# EAGLE board board (EAGLE 9.4.2)
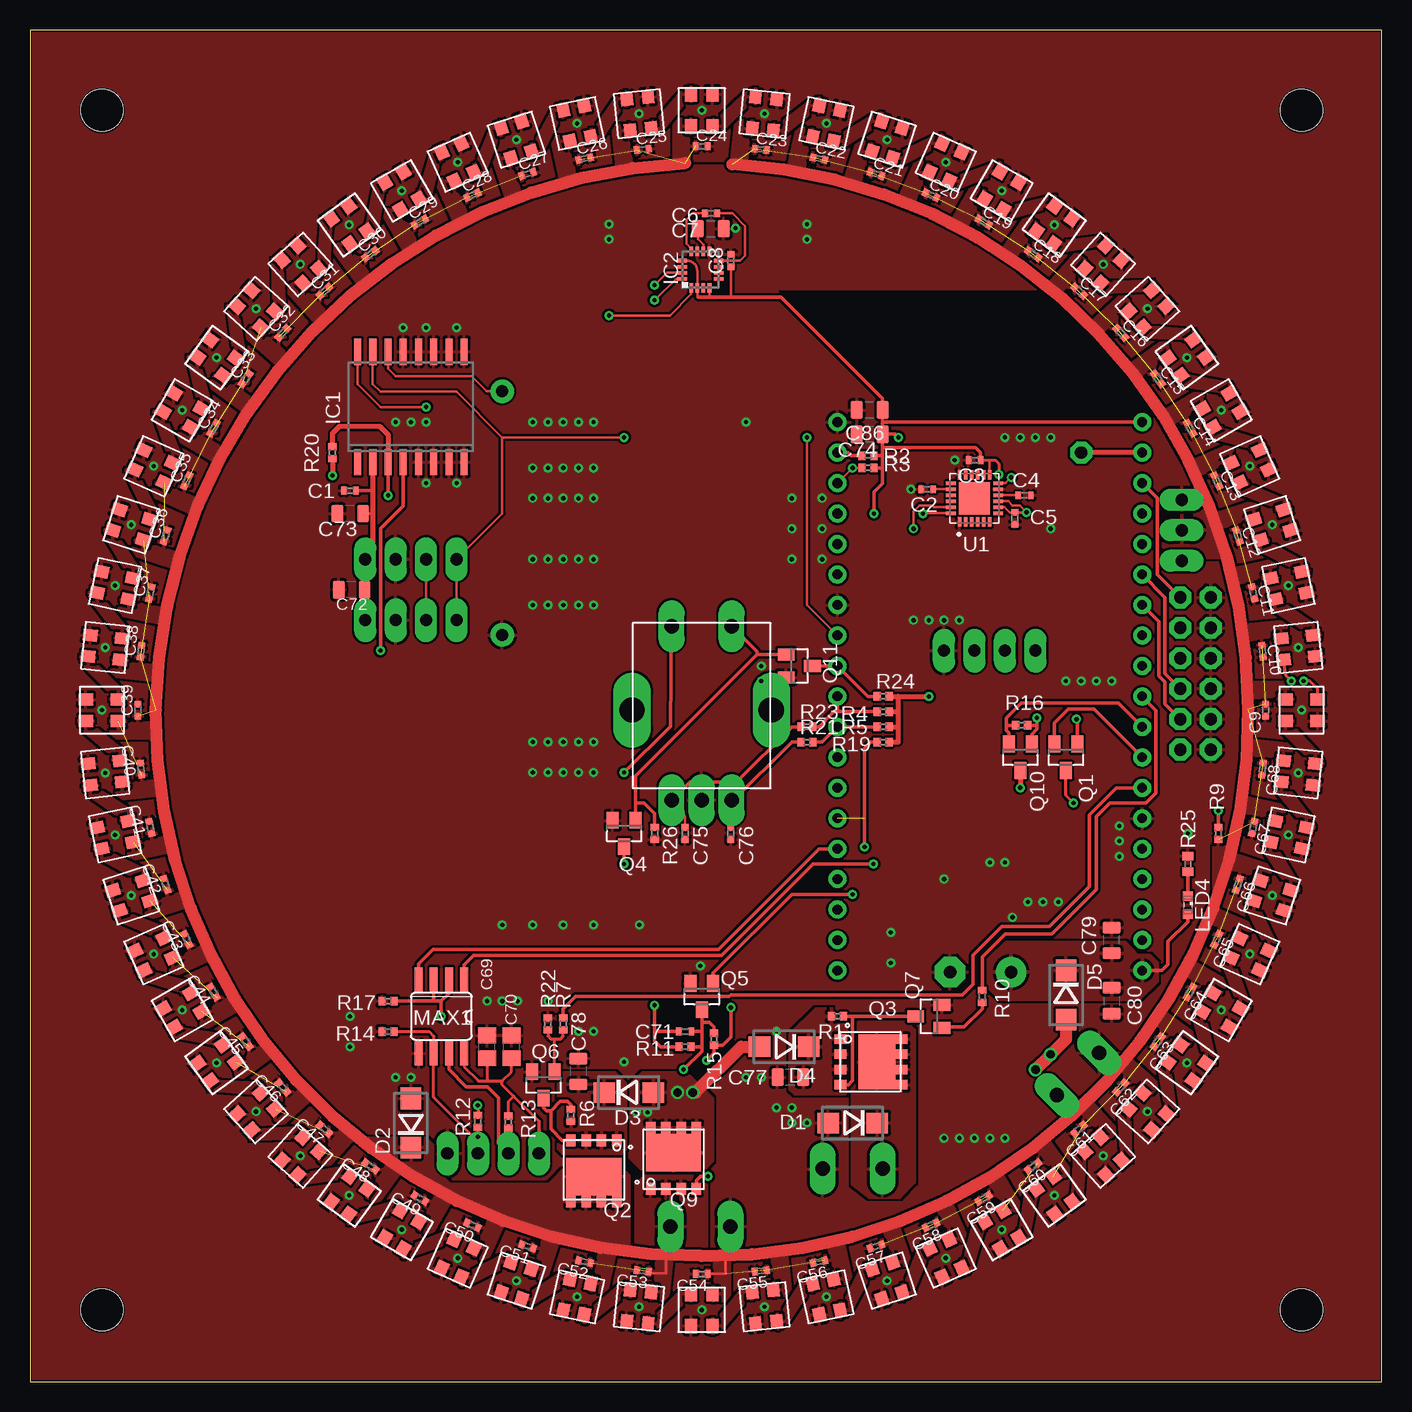
[diagram p5: board, top side]
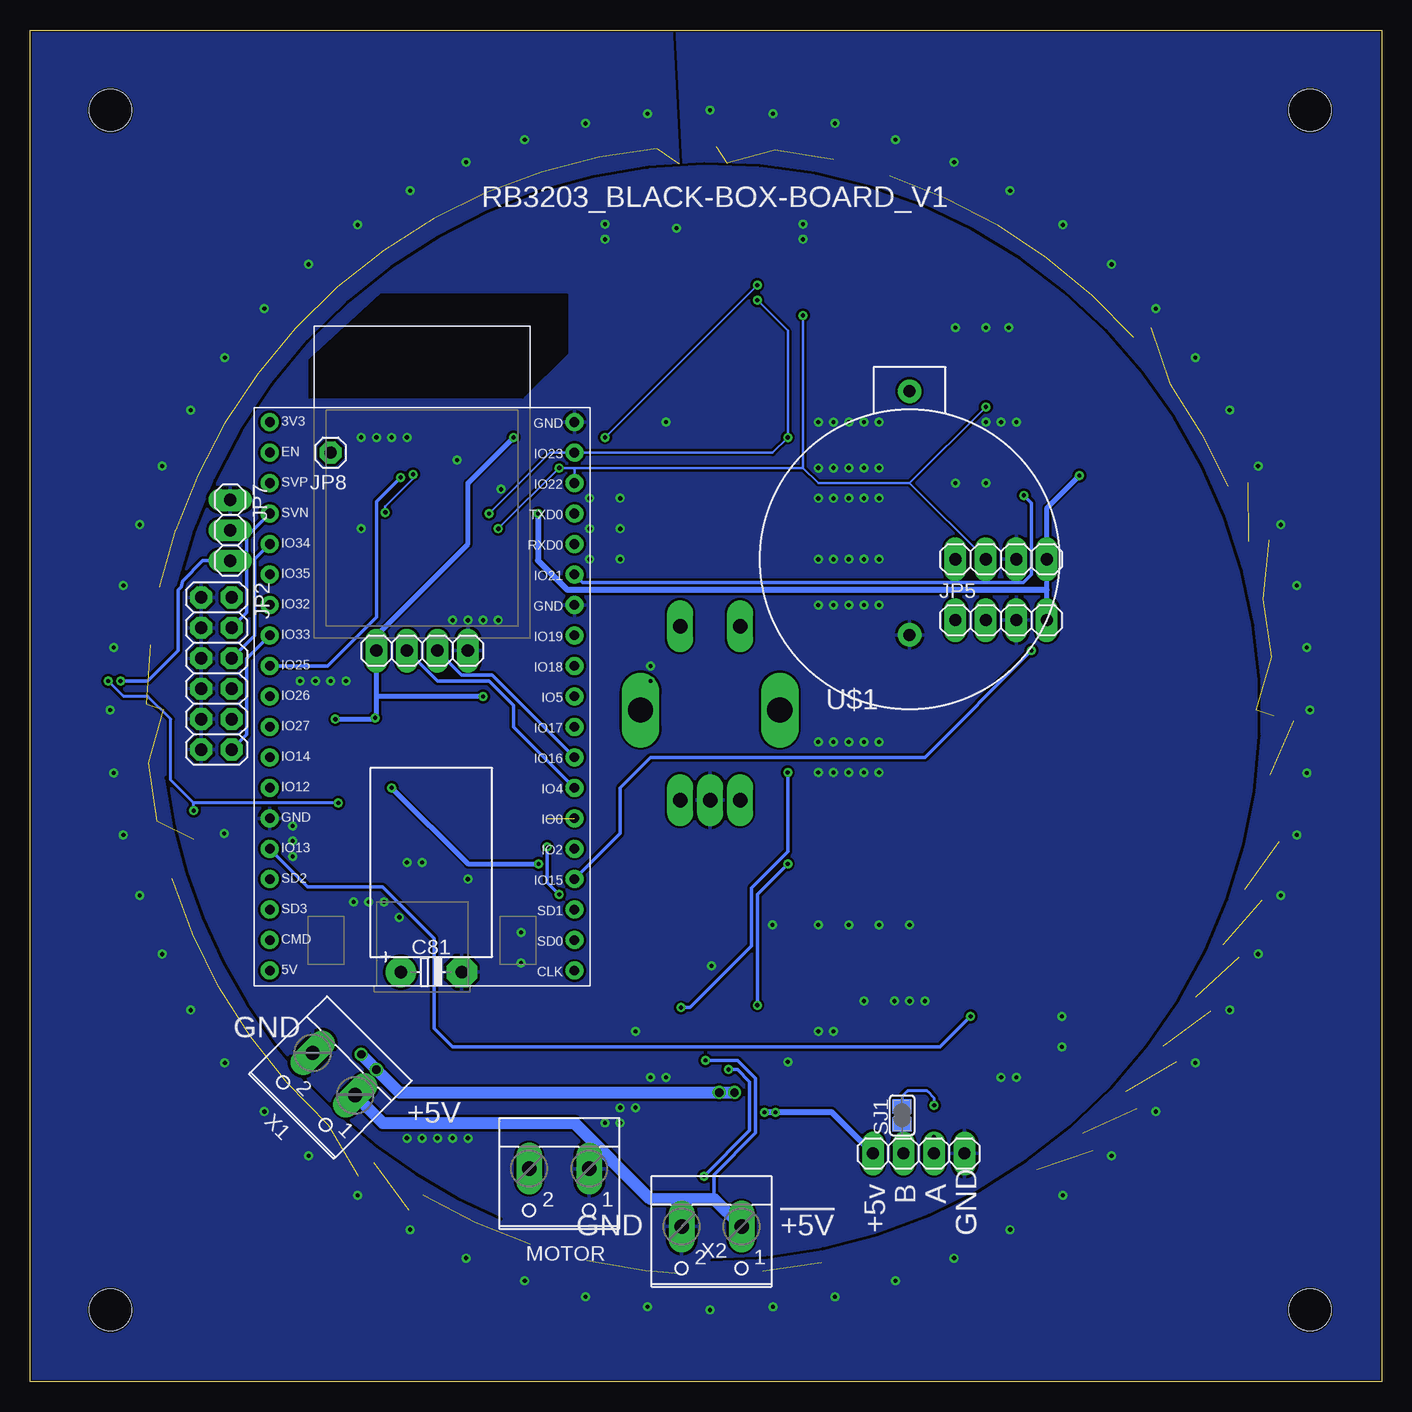
[diagram p6: board, bottom side, seen from below]

Size 112.7 x 112.7 mm. Coordinates in mm from the lower left corner, seen from the top.
Outline: 0,0 112.7,0 112.7,112.7 0,112.7 0,0
Copper layers (1*16): Top 0.035mm / dielectric 1.5mm / Bottom 0.035mm
Design rules "gatema_2layers *": minimum track width 0.15mm, minimum drill 0.3mm, track to track 0.15mm, track to pad 0.15mm, pad to pad 0.15mm, via to via 0.15mm, smd to smd 0mil, copper to edge 0.15mm, drill to drill 0.4mm, minimum pad ring 0.35mm, minimum via ring 0.2mm, stop-mask expansion 2mil, vias tented up to drill 0.4mm, thermal gap 10mil
Net classes: 0 default: width 0.2 mm, drill 0.35 mm, clearance 0.2 mm
Holes 3.5 mm at 6,106 106,106 106,6 6,6
tRestrict: 148 lines
bRestrict: 10 lines

## Footprints (pad centres in the part's own frame; a part is rotated, then mirrored left to right if it is on the bottom)
C0402 = smd 0.5 x 0.6: 1 -0.5,0; 2 0.5,0
C0402P = smd 0.45 x 0.6: 1 -0.525,0; 2 0.525,0
C0805 = smd 1 x 1.5: 1 -1.1,0; 2 1.05,0
C0805' = smd 1.3 x 1.5: 1 -0.95,0; 2 0.95,0
E5-10,5-H = drill 1.016 pad 2.54: + -2.54,0 | drill 1.016 pad 2.54 octagon: - 2.54,0
DO214BA = smd 1.8 x 1.7: A 2.05,0; C -2.05,0
SO16W = smd 0.6 x 2.2: 1 -4.445,-4.6; 2 -3.175,-4.6; 3 -1.905,-4.6; 4 -0.635,-4.6; 5 0.635,-4.6; 6 1.905,-4.6; 7 3.175,-4.6; 8 4.445,-4.6; 9 4.445,4.6; 10 3.175,4.6; 11 1.905,4.6; 12 0.635,4.6; 13 -0.635,4.6; 14 -1.905,4.6; 15 -3.175,4.6; 16 -4.445,4.6
QMC5882L-TR = smd 0.8 x 0.3: 1 -1.524,0.762; 2 -1.524,0.254; 3 -1.524,-0.254; 4 -1.524,-0.762; 9 1.524,-0.762; 10 1.524,-0.254; 11 1.524,0.254; 12 1.524,0.762 | smd 0.3 x 0.8: 5 -0.762,-1.524; 6 -0.254,-1.524; 7 0.254,-1.524; 8 0.762,-1.524; 13 0.762,1.524; 14 0.254,1.524; 15 -0.254,1.524; 16 -0.762,1.524
DEVKITC = drill 0.8: 1 -12.7,46.99; 2 -12.7,44.45; 3 -12.7,41.91; 4 -12.7,39.37; 5 -12.7,36.83; 6 -12.7,34.29; 7 -12.7,31.75; 8 -12.7,29.21; 9 -12.7,26.67; 10 -12.7,24.13; 11 -12.7,21.59; 12 -12.7,19.05; 13 -12.7,16.51; 14 -12.7,13.97; 15 -12.7,11.43; 16 -12.7,8.89; 17 -12.7,6.35; 18 -12.7,3.81; 19 -12.7,1.27; 20 12.7,1.27; 21 12.7,3.81; 22 12.7,6.35; 23 12.7,8.89; 24 12.7,11.43; 25 12.7,13.97; 26 12.7,16.51; 27 12.7,19.05; 28 12.7,21.59; 29 12.7,24.13; 30 12.7,26.67; 31 12.7,29.21; 32 12.7,31.75; 33 12.7,34.29; 34 12.7,36.83; 35 12.7,39.37; 36 12.7,41.91; 37 12.7,44.45; 38 12.7,46.99
1X04 = drill 1.016 long: 1 -3.81,0; 2 -1.27,0; 3 1.27,0; 4 3.81,0
2X06 = drill 1.016 octagon: 1 -6.35,-1.27; 2 -6.35,1.27; 3 -3.81,-1.27; 4 -3.81,1.27; 5 -1.27,-1.27; 6 -1.27,1.27; 7 1.27,-1.27; 8 1.27,1.27; 9 3.81,-1.27; 10 3.81,1.27; 11 6.35,-1.27; 12 6.35,1.27
1X03 = drill 1.016 long: 1 -2.54,0; 2 0,0; 3 2.54,0
1X01 = drill 1.016 octagon: 1 0,0
SML0603 = smd 0.8 x 0.8: A 0.75,0; C -0.75,0
SO08 = smd 0.66 x 2.032: 1 -1.905,-3.073; 2 -0.635,-3.073; 3 0.635,-3.073; 4 1.905,-3.073; 5 1.905,3.073; 6 0.635,3.073; 7 -0.635,3.073; 8 -1.905,3.073
W237-102 = drill 1.194 long: 1 -2.5,-1.27; 2 2.5,-1.27
SOT23 = smd 1 x 1.4: 1 -0.95,-1.1; 2 0.95,-1.1; 3 0,1.1
SOP-8_EP_5.0X5.0X1.27P = smd 0.8 x 1: 1 1.915,2.5; 2 0.645,2.5; 3 -0.625,2.5; 4 -1.895,2.5; 5 -1.895,-2.58; 6 -0.625,-2.58; 7 0.645,-2.58; 8 1.915,-2.58 | smd 4.61 x 3.1: 9 0.01,-0.53
R0402 = smd 0.6 x 0.7: 1 -0.5,0; 2 0.5,0
R0402' = smd 0.7 x 0.9: 1 -0.65,0; 2 0.65,0
SJ = smd 1.168 x 1.6: 1 -0.762,0; 2 0.762,0
QFN50P400X400X95-24N = smd 0.8 x 0.3: 1 -1.97,1.25; 2 -1.97,0.75; 3 -1.97,0.25; 4 -1.97,-0.25; 5 -1.97,-0.75; 6 -1.97,-1.25; 13 1.97,-1.25; 14 1.97,-0.75; 15 1.97,-0.25; 16 1.97,0.25; 17 1.97,0.75; 18 1.97,1.25 | smd 0.3 x 0.8: 7 -1.25,-1.97; 8 -0.75,-1.97; 9 -0.25,-1.97; 10 0.25,-1.97; 11 0.75,-1.97; 12 1.25,-1.97; 19 1.25,1.97; 20 0.75,1.97; 21 0.25,1.97; 22 -0.25,1.97; 23 -0.75,1.97; 24 -1.25,1.97 | smd 2.7 x 2.6: P$1 0,0
CH075 = drill 1 pad 1.93: + 14,0; - -6.3,0
WS2812B-MINI = smd 1.2 x 1: DIN 1.34,0.89; DOUT -1.34,-0.89; GND 1.34,-0.89; VCC -1.34,0.89
EC11-1S = drill 1.2 long: A -7.5,2.5; B -7.5,-2.5; IN -7.5,0; P$4 7,2.5; P$5 7,-2.5 | drill 2.1 long: P$1 0,-5.8; P$2 0,5.8

## Placement (x,y rotation side)
C1  1nf  [C0402]  26.67,74.3 180 top
C2  2.2nf  [C0402]  74.78,74.41 180 top
C3  100nf  [C0402]  78.74,76.83 180 top
C4  100nf  [C0402P]  82.9,73.91 0 top
C5  10nf  [C0402]  82.1,71.99 270 top
C6  220nf  [C0402]  56.77,97.41 0 top
C7  4.7uf  [C0805]  56.77,96.14 0 top
C8  100nf  [C0402P]  58.42,93.47 90 top
C9  [C0402]  103,56 270 top
C10  [C0402]  102.74,60.91 276 top
C11  [C0402]  101.97,65.77 282 top
C12  [C0402]  100.7,70.52 288 top
C13  [C0402]  98.94,75.12 294 top
C14  [C0402]  96.7,79.5 300 top
C15  [C0402]  94.02,83.63 306 top
C16  [C0402]  90.93,87.45 312 top
C17  [C0402]  87.45,90.93 318 top
C18  [C0402]  83.63,94.02 324 top
C19  [C0402]  79.5,96.7 330 top
C20  [C0402]  75.12,98.94 336 top
C21  [C0402]  70.52,100.7 342 top
C22  [C0402]  65.77,101.97 348 top
C23  [C0402]  60.91,102.74 354 top
C24  [C0402]  56,103 0 top
C25  [C0402]  51.09,102.74 6 top
C26  [C0402]  46.23,101.97 12 top
C27  [C0402]  41.48,100.7 18 top
C28  [C0402]  36.88,98.94 24 top
C29  [C0402]  32.5,96.7 30 top
C30  [C0402]  28.37,94.02 36 top
C31  [C0402]  24.55,90.93 42 top
C32  [C0402]  21.07,87.45 48 top
C33  [C0402]  17.98,83.63 54 top
C34  [C0402]  15.3,79.5 60 top
C35  [C0402]  13.06,75.12 66 top
C36  [C0402]  11.3,70.52 72 top
C37  [C0402]  10.03,65.77 78 top
C38  [C0402]  9.26,60.91 84 top
C39  [C0402]  9,56 90 top
C40  [C0402]  9.26,51.09 96 top
C41  100pf  [C0402]  10.03,46.23 102 top
C42  [C0402]  11.3,41.48 108 top
C43  [C0402]  13.06,36.88 114 top
C44  [C0402]  15.3,32.5 120 top
C45  [C0402]  17.98,28.37 126 top
C46  [C0402]  21.07,24.55 132 top
C47  [C0402]  24.55,21.07 138 top
C48  [C0402]  28.37,17.98 144 top
C49  [C0402]  32.5,15.3 150 top
C50  [C0402]  36.88,13.06 156 top
C51  [C0402]  41.48,11.3 162 top
C52  [C0402]  46.23,10.03 168 top
C53  [C0402]  51.09,9.26 174 top
C54  [C0402]  56,9 180 top
C55  [C0402]  60.91,9.26 186 top
C56  [C0402]  65.77,10.03 192 top
C57  [C0402]  70.52,11.3 198 top
C58  [C0402]  75.12,13.06 204 top
C59  [C0402]  79.5,15.3 210 top
C60  [C0402]  83.63,17.98 216 top
C61  [C0402]  87.45,21.07 222 top
C62  [C0402]  90.93,24.55 228 top
C63  [C0402]  94.02,28.37 234 top
C64  [C0402]  96.7,32.5 240 top
C65  [C0402]  98.94,36.88 246 top
C66  [C0402]  100.7,41.48 252 top
C67  [C0402]  101.97,46.23 258 top
C68  [C0402]  102.74,51.09 264 top
C69  10uf  [C0805']  38.1,27.94 90 top
C70  10uf  [C0805']  40.13,27.94 90 top
C71  100nf  [C0402P]  54.61,29.21 180 top
C72  10uf  [C0805]  26.8,66.04 180 top
C73  10uf  [C0805]  26.67,72.39 180 top
C74  10uf  [C0805]  69.98,78.99 180 top
C75  220nf  [C0402]  54.61,45.72 270 top
C76  220nf  [C0402]  58.42,45.72 270 top
C77  10uf  [C0805]  63.37,25.4 180 top
C78  10uf  [C0805]  45.72,25.91 90 top
C79  10uf  [C0805]  90.17,36.83 90 top
C80  10uf  [C0805]  90.17,31.75 270 top
C81  [E5-10,5-H]  79.25,34.16 0 bottom
C86  10uf  [C0805]  69.98,81.03 180 top
D1  [DO214BA]  68.58,21.59 180 top
D2  [DO214BA]  31.75,21.59 90 top
D3  BAT60JDO-214-AB  [DO214BA]  49.91,24.13 0 top
D4  BAT60JDO-214-AB  [DO214BA]  62.87,27.94 180 top
D5  BAT60JDO-214-AB  [DO214BA]  86.36,32.26 270 top
IC1  DS3231/SO  [SO16W]  31.75,81.28 0 top
IC2  QMC5883L-TR  [QMC5882L-TR]  55.88,92.71 90 top
IM1  DEVKITC  [DEVKITC]  80.01,33.02 0 bottom
JP1  [1X04]  38.61,19.05 180 bottom
JP2  [2X06]  97.16,59.05 270 bottom
JP3  [1X04]  80.01,60.96 0 bottom
JP4  [1X04]  31.75,68.58 0 bottom
JP5  [1X04]  31.75,63.5 0 bottom
JP7  [1X03]  96.01,70.99 270 bottom
JP8  [1X01]  87.63,77.47 180 bottom
LED4  powerled  [SML0603]  96.52,39.75 270 top
MAX1  MAX485  [SO08]  34.29,30.48 180 top
MOTOR  [W237-102]  68.58,16.51 180 bottom
Q1  [SOT23]  86.36,52.07 180 top
Q2  AO3401ASOP-8_EP_5.0X5.0X1.27P  [SOP-8_EP_5.0X5.0X1.27P]  46.99,17.65 0 top
Q3  AO3401ASOP-8_EP_5.0X5.0X1.27P  [SOP-8_EP_5.0X5.0X1.27P]  70.08,26.67 90 top
Q4  [SOT23]  49.53,45.72 180 top
Q5  [SOT23]  56,32.13 180 top
Q6  [SOT23]  42.8,24.77 180 top
Q7  [SOT23]  74.93,30.48 90 top
Q9  AO3401ASOP-8_EP_5.0X5.0X1.27P  [SOP-8_EP_5.0X5.0X1.27P]  53.66,18.58 180 top
Q10  [SOT23]  82.55,52.07 180 top
Q11  [SOT23]  64.14,59.69 270 top
R1  300k  [R0402]  67.31,30.48 180 top
R2  10k  [R0402]  69.85,77.22 0 top
R3  10k  [R0402]  69.85,76.2 0 top
R4  10k  [R0402]  71.12,55.88 0 top
R5  10k  [R0402]  71.12,54.61 0 top
R6  300k  [R0402]  45.09,22.23 90 top
R7  220  [R0402]  44.45,29.84 90 top
R9  10k  [R0402]  99.06,45.72 90 top
R10  220  [R0402]  79.38,32.13 90 top
R11  100k  [R0402]  54.61,27.94 180 top
R12  120  [R0402]  37.34,21.72 270 top
R13  20k  [R0402]  39.88,21.65 90 top
R14  20k  [R0402]  29.84,29.21 180 top
R15  100k  [R0402]  57.02,28.57 270 top
R16  10k  [R0402]  82.67,54.73 0 top
R17  100k  [R0402]  29.85,31.76 180 top
R19  100k  [R0402]  71.12,53.34 0 top
R20  47k  [R0402]  25.21,77.47 270 top
R21  180  [R0402]  64.77,53.34 0 top
R22  100k  [R0402]  43.18,29.84 270 top
R23  180  [R0402]  64.77,54.61 0 top
R24  10k  [R0402]  71.12,57.15 0 top
R25  1k  [R0402']  96.52,43.18 90 top
R26  100k  [R0402]  52.07,45.72 270 top
SJ1  [SJ]  40.01,22.23 270 bottom
U1  MPU-6050  [QFN50P400X400X95-24N]  78.74,73.66 90 top
U$1  CR2032  [CH075]  39.37,68.58 90 bottom
U$2  WS2812  [WS2812B-MINI]  105.73,61.23 6 top
U$3  WS2812  [WS2812B-MINI]  104.91,66.4 12 top
U$4  WS2812  [WS2812B-MINI]  103.55,71.45 18 top
U$5  WS2812  [WS2812B-MINI]  101.68,76.34 24 top
U$6  WS2812  [WS2812B-MINI]  99.3,81 30 top
U$7  WS2812  [WS2812B-MINI]  96.45,85.39 36 top
U$8  WS2812  [WS2812B-MINI]  93.16,89.46 42 top
U$9  WS2812  [WS2812B-MINI]  89.46,93.16 48 top
U$10  WS2812  [WS2812B-MINI]  85.39,96.45 54 top
U$11  WS2812  [WS2812B-MINI]  81,99.3 60 top
U$12  WS2812  [WS2812B-MINI]  76.34,101.68 66 top
U$13  WS2812  [WS2812B-MINI]  71.45,103.55 72 top
U$14  WS2812  [WS2812B-MINI]  66.4,104.91 78 top
U$15  WS2812  [WS2812B-MINI]  61.23,105.73 84 top
U$16  WS2812  [WS2812B-MINI]  56,106 90 top
U$17  WS2812  [WS2812B-MINI]  50.77,105.73 96 top
U$18  WS2812  [WS2812B-MINI]  45.6,104.91 102 top
U$19  WS2812  [WS2812B-MINI]  40.55,103.55 108 top
U$20  WS2812  [WS2812B-MINI]  35.66,101.68 114 top
U$21  WS2812  [WS2812B-MINI]  31,99.3 120 top
U$22  WS2812  [WS2812B-MINI]  26.61,96.45 126 top
U$23  WS2812  [WS2812B-MINI]  22.54,93.16 132 top
U$24  WS2812  [WS2812B-MINI]  18.84,89.46 138 top
U$25  WS2812  [WS2812B-MINI]  15.55,85.39 144 top
U$26  WS2812  [WS2812B-MINI]  12.7,81 150 top
U$27  WS2812  [WS2812B-MINI]  10.32,76.34 156 top
U$28  WS2812  [WS2812B-MINI]  8.45,71.45 162 top
U$29  WS2812  [WS2812B-MINI]  7.09,66.4 168 top
U$30  WS2812  [WS2812B-MINI]  6.27,61.23 174 top
U$31  WS2812  [WS2812B-MINI]  6,56 180 top
U$32  WS2812  [WS2812B-MINI]  6.27,50.77 186 top
U$33  WS2812  [WS2812B-MINI]  7.09,45.6 192 top
U$34  WS2812  [WS2812B-MINI]  8.45,40.55 198 top
U$35  WS2812  [WS2812B-MINI]  10.32,35.66 204 top
U$36  WS2812  [WS2812B-MINI]  12.7,31 210 top
U$37  WS2812  [WS2812B-MINI]  15.55,26.61 216 top
U$38  WS2812  [WS2812B-MINI]  18.84,22.54 222 top
U$39  WS2812  [WS2812B-MINI]  22.54,18.84 228 top
U$40  WS2812  [WS2812B-MINI]  26.61,15.55 234 top
U$41  WS2812  [WS2812B-MINI]  31,12.7 240 top
U$42  WS2812  [WS2812B-MINI]  35.66,10.32 246 top
U$43  WS2812  [WS2812B-MINI]  40.55,8.45 252 top
U$44  WS2812  [WS2812B-MINI]  45.6,7.09 258 top
U$45  WS2812  [WS2812B-MINI]  50.77,6.27 264 top
U$46  WS2812  [WS2812B-MINI]  56,6 270 top
U$47  WS2812  [WS2812B-MINI]  61.23,6.27 276 top
U$48  WS2812  [WS2812B-MINI]  66.4,7.09 282 top
U$49  WS2812  [WS2812B-MINI]  71.45,8.45 288 top
U$50  WS2812  [WS2812B-MINI]  76.34,10.32 294 top
U$51  WS2812  [WS2812B-MINI]  81,12.7 300 top
U$52  WS2812  [WS2812B-MINI]  85.39,15.55 306 top
U$53  WS2812  [WS2812B-MINI]  89.46,18.84 312 top
U$54  WS2812  [WS2812B-MINI]  93.16,22.54 318 top
U$55  WS2812  [WS2812B-MINI]  96.45,26.61 324 top
U$56  WS2812  [WS2812B-MINI]  99.3,31 330 top
U$57  WS2812  [WS2812B-MINI]  101.68,35.66 336 top
U$58  WS2812  [WS2812B-MINI]  103.55,40.55 342 top
U$59  WS2812  [WS2812B-MINI]  104.91,45.6 348 top
U$60  WS2812  [WS2812B-MINI]  105.73,50.77 354 top
U$61  WS2812  [WS2812B-MINI]  106,56 0 top
U$62  EC11-1S  [EC11-1S]  56,56 90 top
X1  [W237-102]  88.27,24.77 135 bottom
X2  [W237-102]  55.88,11.68 180 bottom

## Tracks (layer width: path | path; a pad name or v marks a point on that pad's centre or on a via)
3,3!KNOFLIK
  Top 0.2: IC1.14 29.84,84.45 30.46,83.84 36.81,83.84 38.07,82.58 U$1.+
!ENC-A
  Top 0.2: U$62.A 54.61,47.15 C75.1
  Top 0.305: U$62.A 55.01,50.01 58.9,50.01 63.5,54.61 R23.1
!ENC-B
  Top 0.2: C76.1 58.42,48.26 58.54,48.38
  Top 0.305: R21.1 63.5,53.34 58.54,48.38 U$62.B
+3V3  (via drill 0.35)
  Top 0.2: U1.13 79.99,76.83 | U1.8 81.25,72.91 81.67,72.49 C5.1 v83.08,72.49 | IC2.13 54.76,93.47 arc-45 55.37,93.22 arc-45 55.63,92.61 IC2.2 55.63,90.47 55.68,90.42 | v83.08,72.49 | C8.1 58.42,90.42 | IC2.4 56.64,90.42 | U1.9 81.55,73.41 81.91,73.06 82.51,73.06 v83.08,72.49
  Top 0.254: C73.1 28.57,72.39 | C3.1 79.99,76.83 80.47,76.83 80.75,76.55 v80.75,75.66
  Top 0.305: Q10.1 83.5,53.98 83.94,54.42 83.94,54.73 | R16.2 83.94,54.73 | 83.94,54.73 v83.94,55.37 | v87.25,55.24 87.31,55.18 Q1.1 | C1.1 28.57,74.3 | C3.1 79.24,77.46 78.82,77.88 71.08,77.88 | 27.94,66.04 | 27.94,66.04 C72.1 | C74.1 71.08,80.01 | 71.08,80.01 IM1.1 | C74.1 71.08,77.88 | R2.2 71.08,77.22 | 71.08,77.22 71.08,77.88 | R3.2 71.08,76.2 | 71.08,77.22 71.08,76.2 | 71.08,76.2 71.08,74.89 70.36,74.17 v70.36,72.39 | 71.08,80.01 C86.1 71.08,81.96 62.61,90.42 58.42,90.42 56.64,90.42 55.68,90.42 | C74.1 72.14,78.99 v72.39,78.74 | JP5.4
  Top 0.406: R5.2 72.39,54.61 | IC1.2 28.57,74.3 28.57,72.39 28.57,69.22 JP4.4 27.94,66.04 | R19.2 72.39,53.34 72.39,54.61 | R4.2 72.39,55.88 | 72.39,54.61 72.39,55.88 | 72.39,55.88 72.39,57.15 | R20.2 v25.21,75.56 | R24.2 72.39,57.15 | 72.39,57.15 v74.93,57.15 | C72.1 27.94,66 JP5.4
  Bottom 0.2: v83.08,72.49 83.08,72.99 80.75,75.32 v80.75,75.66
  Bottom 0.305: 83.82,55.48 83.82,57.15 JP3.1
  Bottom 0.406: v25.21,75.56 27.94,72.83 JP4.4 27.94,66.04 JP5.4 | v74.93,57.15 83.82,57.15 | v87.25,55.24 84.06,55.24 v83.94,55.37 83.82,55.48 JP3.1 83.82,62.23 76.2,69.85 76.2,74.93 v72.39,78.74
  Bottom 0.508: 27.94,66.04 67.92,66.04 70.36,68.47 v70.36,72.39
+5V  (via drill 0.35, 0.7)
  Top 0.254: 40.32,23.81 39.37,24.75 39.37,25.09 | 42.42,21.7 40.32,23.81 | MAX1.8 36.2,26.27 37.38,25.09 38.1,25.09 | C69.1 38.1,25.09 | 38.1,25.09 39.37,25.09 | R13.2 39.88,23.37 40.32,23.81 | 39.37,25.09 40.13,25.85 C70.1
  Top 0.305: JP1.4 42.42,21.7
  Top 1.016: D5.A 86.36,28.57 v85.09,27.3 v83.82,26.04 | v55.24,24.13 55.5,24.13 59.31,27.94 D4.A
  Bottom 0.508: JP1.4 45.85,22.48 v50.55,22.48 v51.47,22.48
  Bottom 1.016: v85.09,27.3 81.92,24.13 v55.24,24.13 v53.98,24.13
  pour Top (rank 2): 50.04,24.77 50.04,18.67 51.18,17.53 56.01,17.53 56.9,18.41 56.9,23.62 54.74,25.78 51.05,25.78
+5VA
  Top 0.305: IM1.19 94.36,34.29 94.87,34.8 94.87,36.72 96.52,38.37 LED4.A
  pour Top: 79.76,35.56 79.76,33.02 80.9,31.88 92.46,31.88 93.98,33.4 93.98,34.92 93.34,35.56 92.33,35.56 91.31,36.62 80.77,36.62
A  (via drill 0.35)
  Top 0.254: R12.2 v37.34,20.44 36.95,20.44 33.66,23.73 MAX1.6 33.66,28.82 33.26,29.21 R14.1
  Bottom 0.305: JP1.2 v37.34,20.44
B
  Top 0.254: 39.05,19.99 39.05,20.32
  Top 0.305: R13.1 JP1.3 39.05,19.88 39.05,20.32 39.05,23.69 38.13,24.61 36.35,24.61 34.92,26.04 MAX1.7
  Bottom 0.254: 39.88,21.34 SJ1.2
  Bottom 0.305: SJ1.2 40.01,19.18 JP1.3
DS3231/RST  (via drill 0.35)
  Top 0.305: IC1.4 31.11,73.03 29.21,71.12 v29.21,60.96
  Bottom 0.305: v29.21,60.96 38.1,52.07 60.96,52.07 63.5,49.53 63.5,45.72 IM1.23
ENC-A
  Top 0.305: R23.2 65.79,54.61 66.21,55.03 | 66.21,55.03 66.28,55.1 | R4.1 67.31,55.88 | 66.21,55.03 66.21,55.07 67.02,55.88 67.31,55.88 | IM1.29 67.31,55.88
ENC-B
  Top 0.305: R21.2 66.04,53.34 IM1.28 R5.1
ESP_SHUTDOWN  (via drill 0.35)  (1 unrouted)
  Top 0.305: v68.58,40.64 63.5,40.64 56.95,34.09 Q5.1 | v69.58,44.6 69.58,46.99 69.58,52.81 70.1,53.34 R19.1
  Bottom 0.305: v69.58,44.6 69.58,41.64 v68.58,40.64
GND  (via drill 0.35)
  other vias: 58.8,96.18 41.91,53.34 43.18,53.34 45.72,53.34 45.72,50.8 43.18,50.8 41.91,50.8 46.99,50.8 46.99,53.34 73.66,63.5 74.93,63.5 76.2,63.5 77.47,63.5 80.01,43.31 81.28,43.31 76.2,41.91 106.01,56 56,5.99 61.23,6.27 66.4,7.09 71.45,8.44 76.34,10.32 81,12.69 85.39,15.54 89.46,18.84 93.16,22.54 96.46,26.61 99.31,31 101.68,35.66 103.56,40.55 104.91,45.6 105.73,50.77 105.73,61.23 104.91,66.4 103.56,71.45 101.68,76.34 99.31,81 96.46,85.39 93.16,89.46 89.46,93.16 85.39,96.46 81,99.31 76.34,101.68 71.45,103.56 66.4,104.91 61.23,105.73 56,106.01 50.77,105.73 45.6,104.91 40.55,103.56 35.66,101.68 31,99.31 26.61,96.46 22.54,93.16 18.84,89.46 15.54,85.39 12.69,81 10.32,76.34 8.44,71.45 7.09,66.4 6.27,61.23 5.99,56 6.27,50.77 7.09,45.6 8.44,40.55 10.32,35.66 12.69,31 15.54,26.61 18.84,22.54 22.54,18.84 26.61,15.54 31,12.69 35.66,10.32 40.55,8.44 45.6,7.09 50.77,6.27 43.18,31.75 38.1,31.75 39.37,31.75 40.64,31.75 31.75,25.4 30.48,25.4 26.67,30.48 26.67,27.94 59.69,25.4 62.23,29.21 83.19,40.01 71.75,37.47 71.75,34.92 81.92,38.73 50.8,38.1 46.99,38.1 44.45,38.1 41.91,38.1 39.37,38.1 31.11,87.88 33.02,87.88 35.56,87.88 73.44,74.41 41.91,76.2 43.18,76.2 44.45,76.2 46.99,76.2 30.48,80.01 31.75,80.01 33.02,80.01 85.09,71.12 55.88,34.67 96.52,45.72 77.47,20.32 78.74,20.32 80.01,20.32 76.2,20.32 81.28,20.32 59.69,80.01 33.02,74.93 35.56,74.93 43.18,64.77 44.45,64.77 64.77,96.52 48.26,96.52 48.26,95.25 64.77,95.25 45.72,76.2 45.72,64.77 46.99,64.77 41.91,73.66 43.18,73.66 44.45,73.66 45.72,73.66 46.99,73.66 46.99,80.01 45.72,80.01 44.45,80.01 43.18,80.01 41.91,80.01 41.91,64.77 44.45,53.34 44.45,50.8 41.91,68.58 43.18,68.58 44.45,68.58 45.72,68.58 46.99,68.58 81.28,78.74 82.55,78.74 83.82,78.74 85.09,78.74 64.77,21.59 63.5,21.59 62.23,22.86 60.96,25.4 63.5,22.86 46.99,29.21 45.72,29.21 49.53,26.67 86.36,58.42 87.63,58.42 88.9,58.42 90.17,58.42 77.09,76.83 90.81,45.09 90.81,46.35 90.81,43.81 60.96,58.42 60.96,59.69 63.5,73.66 63.5,71.12 63.5,68.58 66.04,71.12 66.04,73.66 66.04,68.58 84.45,40.01 85.72,40.01
  pour Top (rank 6): -1.15,114.42 -1.15,-1.15 114.42,-1.15 114.42,114.42
  pour Bottom: -2.42,115.69 -2.42,-2.42 115.69,-2.42 115.69,115.69
INT_MPU5060  (via drill 0.35)
  Top 0.2: v81.8,75.4 81.31,74.91 U1.12
  Bottom 0.305: v81.8,75.4 83.82,73.38 83.82,63.75 87.88,59.69 IM1.9
IO32
  Top 0.305: JP2.10 94.62,56.51 94.62,58.34 94.11,58.84 94.11,62.35 94.11,62.36 94.11,63.37 IM1.7
IO33
  Bottom 0.305: IM1.8 94.62,60.32 94.62,53.97 JP2.12
IO34
  Bottom 0.305: IM1.5 93.98,68.58 93.98,62.23 JP2.6
IO35
  Top 0.305: IM1.6 94.62,65.4 94.62,59.05 JP2.8
LED4
  Top 0.305: LED4.C R25.1
LED-SHUTDOWN
  Top 0.29: 52.07,32.13 57.15,32.13
  Top 0.305: R7.2 44.45,31.11 45.47,32.13 52.07,32.13 | 57.15,32.13 58.27,32.13 58.42,32.28 77.75,32.28 78.61,33.15 78.61,35.56 81.03,37.97 84.96,37.97 88.3,41.31 88.3,47.28 90.55,49.53 IM1.13
MODE_485  (via drill 0.35)
  Top 0.305: v34.29,30.48 34.29,31.74 | R17.1 33.66,31.76 | 33.66,31.76 34.28,31.76 34.29,31.74 | 34.29,31.74 34.92,32.38 MAX1.2 | MAX1.3 33.66,31.76
  Bottom 0.305: v34.29,30.48 36.83,27.94 77.47,27.94 78.99,29.46 78.99,36.96 83.31,41.27 88.9,41.27 89.53,41.27 IM1.15
MOTOR
  Top 0.305: R10.2 79.38,35.43 81.3,37.36 85.19,37.36 88.9,41.07 88.9,47.12 90.04,48.26 93.03,48.26 93.87,49.1 93.87,55.99 IM1.10
N$1
  Top 0.2: U1.20 76.2,74.41 75.84,74.41 C2.1
N$2  (via drill 0.35)
  Top 0.305: Q4.3 v49.53,43.18 | R11.2 52.58,27.94 52.07,28.45 52.07,29.21 | 52.07,29.21 v52.07,31.4 | C71.2 52.07,29.21
  Bottom 0.305: v49.53,43.18 52.07,40.64 v52.07,31.4
N$3
  Top 0.2: U1.10 C4.1
N$6  (via drill 0.35)
  Top 0.305: Q9.4 55.55,16.82 55.88,17.14 v56.52,17.14 | 56,27.94 56,27.55 v54.48,26.04 | 56,27.94 56,29.21 | 56,29.21 56,29.97 | 56,29.97 Q5.3 | R11.1 56,27.94 | R15.1 57.02,29.59 56.64,29.97 56,29.97 | C71.1 56,29.21
  Bottom 0.305: v56.52,17.14 52.7,20.95 52.7,25.02 53.72,26.04 v54.48,26.04
N$7
  pour Top: 44.07,19.43 44.58,18.92 49.15,18.92 49.66,19.43 49.66,24.89 48.77,25.78 44.45,25.78 44.07,25.4
N$8  (via drill 0.35)
  Top 0.254: v37.33,23.04 v37.34,23.04 R12.1
  Bottom 0.254: v37.33,23.04 37.33,23.68 37.9,24.25 39.55,24.25 40.01,23.8 SJ1.1
N$9  (via drill 0.35)
  Top 0.254: U$2.DOUT 104.54,59.74 | 104.54,59.74 | 104.54,59.74 104.59,59.31 arc35 104.82,58.75 v105.16,58.42
  Bottom 0.305: JP7.3 98.3,68.45 99.97,66.78 100.09,66.25 100.33,66.02 100.33,60.96 102.87,58.42 v105.16,58.42
N$10
  Top 0.406: IM1.2 JP8.1
N$11
  pour Top (rank 2): 68.52,29.49 68.52,16.45 69.97,15.36 72.51,15.36 73.78,16.63 73.78,29.36 72.93,30.22 69.25,30.22
N$12
  Top 0.305: Q3.4 68.21,24.77 68.58,25.15 68.58,30.48 | 68.58,30.48 Q7.3 | R1.1 68.58,30.48
N$13
  Top 0.305: Q7.1 76.09,29.59 77.85,29.59 79.38,31.11 R10.1
N$14
  pour Top: 63.37,28.96 63.37,24.38 63.75,24 67.94,24 68.33,24.38 68.33,30.1 67.31,31.11 65.53,31.11
N$47
  pour Top: 74.18,11.32 74.76,11.57 75.2,10.64 74.78,10.45 73.36,7.02 72.87,6.87 72.5,8 72.99,8.16
N$60
  Top 0.2: C6.1 55.24,97.41 54.74,96.9 54.74,94.87 55.12,94.49 IC2.12
N$62
  Top 0.2: C6.2 58.55,97.41 59.59,96.37 59.59,93.88 59.18,93.47 IC2.8
N$66
  Top 0.2: C7.1 55.67,95.25 56.13,94.78 IC2.10
N$68
  Top 0.305: R6.2 45.09,23.11 44.83,23.37 44.2,23.37 43.43,22.61 | 43.43,22.61 43.05,22.61 42.8,22.86 Q6.3 | Q2.4 44.37,20.15 43.43,21.08 43.43,22.61
N$69
  Top 0.254: R22.2 43.18,28.83 43.43,28.57 43.75,28.57 | R7.1 44.45,28.83 44.2,28.57 43.75,28.57 | Q6.1 43.75,28.57
QMC5883-INTERRUPT  (via drill 0.35)
  Top 0.2: IC2.15 53.09,92.46 v52.07,91.44 | IM1.31 64.77,64.77 v64.77,78.74
  Bottom 0.2: v52.07,91.44 v64.77,78.74
RX-485-5V  (via drill 0.35)
  Top 0.305: MAX1.1 36.2,34.77 36.99,35.56 57.66,35.56 65.28,43.18 v70.3,43.18
  Top 0.406: Q10.3 v82.55,49.53
  Bottom 0.406: v82.55,49.53 76.2,43.18 v70.3,43.18
RX-GPS
  Bottom 0.305: JP3.2 78.74,58.42 74.42,58.42 72.39,56.39 72.39,54.61 IM1.26
RX_485
  Top 0.305: 81.4,54.73 81.4,54.31 81.6,54.11 Q10.2 | 81.4,54.73 R16.1 | 81.4,54.73 81.4,55.37 82.64,56.6 90.17,56.6 90.72,56.6 IM1.11
SCL  (via drill 0.35)  (1 unrouted)
  Top 0.2: IC1.16 27.3,83.19 29.21,81.28 v33.02,81.28 | IC2.1 55.12,90.68 53.34,88.9 v48.26,88.9 | U1.23 75.36,72.91 75.21,73.06 74.15,73.06 73.66,72.58 v73.66,71.12 | JP4.2 JP5.2 | R3.1 v68.58,76.2 IM1.36
  Bottom 0.2: v73.66,71.12 v68.58,76.2 | JP4.2 39.37,74.93 | 39.37,74.93 46.99,74.93 48.26,76.2 | 39.37,74.93 v33.02,81.28 | v48.26,88.9 48.26,76.2 | v68.58,76.2 | v68.58,76.2 67.31,76.2 | 67.31,76.2 48.26,76.2 | 67.31,76.2 IM1.36
SDA  (via drill 0.35)
  Top 0.2: IC1.15 28.57,83.19 29.21,82.55 35.56,82.55 39.37,78.74 | U1.24 74.45,72.41 v74.43,72.39 | v52.07,90.17 53.85,91.95 IC2.16 | v49.53,78.74 39.37,78.74 | 39.37,78.74 39.37,72.39 JP4.1 JP5.1
  Top 0.305: R2.1 68.45,77.22 68.2,77.47 IM1.37
  Bottom 0.2: v74.43,72.39 69.35,77.47 IM1.37 50.8,77.47 v49.53,78.74 49.53,87.63 v52.07,90.17
SQW/INT  (via drill 0.35)
  Top 0.305: IC1.3 v29.84,73.9
  Top 0.406: R20.1 25.21,79.08 25.78,79.65 29.17,79.65 29.84,78.98 IC1.3
  Bottom 0.305: 29.2,73.26 v29.84,73.9 29.21,73.27 29.21,67.31 29.87,66.65 66.65,66.65 IM1.33
SVN
  Bottom 0.305: IM1.4 94.62,70.48 94.62,64.13 JP2.4
SVP
  Top 0.305: JP2.2 93.98,67.31 93.98,73.66 IM1.3
SW
  Top 0.305: Q11.3 IM1.30 69.85,57.15 R24.1
SW0  (via drill 0.35)
  Top 0.305: U$62.P$4 53.38,54.65 v49.53,50.8 | v56.39,26.8 57.02,27.43 R15.2 57.72,28.07 58.42,28.78 v58.42,31.21
  Bottom 0.305: 55.67,15.24 55.67,17.28 52.2,20.75 52.2,25.29 53.72,26.8 v56.39,26.8 | v49.53,50.8 49.53,44.21 52.58,41.16 52.58,36.33 57.69,31.21 v58.42,31.21
  Bottom 1.016: X2.1 55.67,15.24 60.96,15.24 67.31,21.59 83.29,21.59 X1.1
  pour Top: 50.48,16.44 50.48,11.36 51.24,10.6 56,10.6 56.44,11.04 56.44,16.45 55.75,17.14 51.18,17.14
SW1
  Top 0.305: Q11.1 60.62,60.64 | Q4.1 50.48,48.26 | 50.48,48.26 50.48,50.5 60.62,60.64 | 50.48,48.26 51.18,48.26 52.07,47.37 R26.1 | U$62.P$5 60.62,60.88 60.62,60.64
TX-GPS
  Bottom 0.305: JP3.3 76.7,58.92 74.17,58.92 IM1.27
TX_485
  Top 0.305: MAX1.4 32.38,34.84 33.6,36.06 57.4,36.06 65.79,44.45 IM1.24
VCC  (54 unrouted)
  Top 0.2: C53.1 51.68,9.07 53.01,9.07 53.01,10.5 56,10.5 57.99,10.5 57.99,9 C54.1
  Top 1.016: 58.55,101.5 arc-87 101.56,56.06 arc-92 56,10.5 arc-92 10.5,56 arc-87 54.61,101.6
  pour Top (rank 2): 102.63,56.13 103.37,56.13 103.37,57.04 104.08,57.37 104.08,56.89 105.25,56.89 105.25,58.31 101.72,58.31 101.72,57.27 101.92,57.07 102.63,57.07
  pour Top (rank 2): 102.37,61 103.1,61.08 103,61.99 103.68,62.39 103.73,61.83 104.9,61.95 104.74,63.45 101.23,63.08 101.34,62.04 101.56,61.86 102.27,61.94
  pour Top (rank 2): 101.59,65.82 102.31,65.97 102.12,66.87 102.75,67.34 102.87,66.78 104.01,67.02 103.69,68.5 100.24,67.77 100.46,66.75 100.7,66.59 101.39,66.74
  pour Top (rank 2): 100.31,70.53 101.01,70.76 100.73,71.63 101.31,72.16 101.44,71.74 102.55,72.1 102.13,73.42 98.77,72.33 99.09,71.34 99.35,71.21 100.02,71.43
  pour Top (rank 2): 98.55,75.08 99.22,75.38 98.85,76.22 99.37,76.81 99.6,76.3 100.66,76.77 100.05,78.14 96.83,76.71 97.25,75.76 97.52,75.65 98.17,75.94
  pour Top (rank 2): 96.32,79.43 96.96,79.8 96.5,80.59 96.95,81.23 97.21,80.79 98.22,81.38 97.5,82.63 94.44,80.86 94.96,79.96 95.24,79.89 95.85,80.24
  pour Top (rank 2): 93.65,83.51 94.25,83.95 93.71,84.69 94.09,85.37 94.33,85.04 95.28,85.73 94.49,86.82 91.63,84.74 92.24,83.9 92.53,83.86 93.1,84.27
  pour Top (rank 2): 90.57,87.3 91.12,87.79 90.51,88.47 90.81,89.19 91.06,88.92 91.93,89.7 91.05,90.67 88.43,88.31 89.13,87.54 89.41,87.52 89.94,88
  pour Top (rank 2): 87.11,90.74 87.6,91.29 86.92,91.9 87.15,92.65 87.57,92.28 88.35,93.15 87.24,94.15 84.88,91.52 85.65,90.83 85.94,90.84 86.41,91.37
  pour Top (rank 2): 83.31,93.8 83.74,94.4 83,94.94 83.15,95.71 83.53,95.43 84.21,96.38 83.08,97.2 81,94.35 81.85,93.73 82.13,93.78 82.55,94.36
  pour Top (rank 2): 79.21,96.45 79.58,97.09 78.78,97.55 78.85,98.33 79.3,98.07 79.89,99.08 78.62,99.81 76.86,96.75 77.76,96.23 78.04,96.3 78.39,96.92
  pour Top (rank 2): 74.85,98.65 75.15,99.33 74.32,99.7 74.3,100.48 74.76,100.28 75.23,101.35 73.92,101.93 72.48,98.71 73.44,98.28 73.7,98.39 73.99,99.04
  pour Top (rank 2): 70.29,100.39 70.52,101.09 69.65,101.37 69.55,102.15 69.97,102.02 70.33,103.13 69.02,103.55 67.93,100.2 68.92,99.87 69.18,100.01 69.4,100.68
  pour Top (rank 2): 65.57,101.64 65.72,102.36 64.83,102.55 64.66,103.32 65.06,103.23 65.31,104.37 63.98,104.66 63.24,101.2 64.26,100.99 64.5,101.14 64.65,101.84
  pour Top (rank 2): 60.75,102.39 60.83,103.12 59.92,103.22 59.66,103.96 60.13,103.91 60.25,105.08 58.85,105.22 58.48,101.71 59.52,101.6 59.74,101.78 59.81,102.49
  pour Top (rank 2): 55.87,102.63 55.87,103.37 54.96,103.37 54.63,104.08 55.09,104.08 55.09,105.25 53.69,105.25 53.69,101.72 54.73,101.72 54.93,101.92 54.93,102.63
  pour Top (rank 2): 51,102.37 50.92,103.1 50.01,103 49.61,103.68 49.98,103.71 49.86,104.88 48.55,104.74 48.92,101.23 49.96,101.34 50.14,101.56 50.06,102.27
  pour Top (rank 2): 46.18,101.59 46.03,102.31 45.13,102.12 44.66,102.75 45.02,102.82 44.78,103.97 43.5,103.69 44.23,100.24 45.25,100.46 45.41,100.7 45.26,101.39
  pour Top (rank 2): 41.47,100.31 41.24,101.01 40.37,100.73 39.84,101.31 40.28,101.45 39.92,102.56 38.58,102.13 39.67,98.77 40.66,99.09 40.79,99.35 40.57,100.02
  pour Top (rank 2): 36.92,98.55 36.62,99.22 35.78,98.85 35.19,99.37 35.66,99.58 35.19,100.65 33.86,100.05 35.29,96.83 36.24,97.25 36.35,97.52 36.06,98.17
  pour Top (rank 2): 32.57,96.32 32.2,96.96 31.41,96.5 30.77,96.95 31.16,97.18 30.58,98.19 29.37,97.5 31.14,94.44 32.04,94.96 32.11,95.24 31.76,95.85
  pour Top (rank 2): 28.49,93.65 28.05,94.25 27.31,93.71 26.63,94.09 26.92,94.31 26.24,95.25 25.18,94.49 27.26,91.63 28.1,92.24 28.14,92.53 27.73,93.1
  pour Top (rank 2): 24.7,90.57 24.21,91.12 23.53,90.51 22.81,90.81 23.14,91.12 22.36,91.98 21.33,91.05 23.69,88.43 24.46,89.13 24.48,89.41 24,89.94
  pour Top (rank 2): 21.26,87.11 20.71,87.6 20.1,86.92 19.35,87.15 19.67,87.51 18.8,88.29 17.85,87.24 20.48,84.88 21.17,85.65 21.16,85.94 20.63,86.41
  pour Top (rank 2): 18.2,83.31 17.6,83.74 17.06,83 16.29,83.15 16.62,83.59 15.67,84.28 14.8,83.08 17.65,81 18.27,81.85 18.22,82.13 17.65,82.55
  pour Top (rank 2): 15.55,79.21 14.91,79.58 14.45,78.78 13.67,78.85 13.94,79.31 12.92,79.89 12.19,78.62 15.25,76.86 15.77,77.76 15.7,78.04 15.08,78.39
  pour Top (rank 2): 13.35,74.85 12.67,75.15 12.3,74.32 11.52,74.3 11.69,74.7 10.63,75.18 10.07,73.92 13.29,72.48 13.72,73.44 13.61,73.7 12.96,73.99
  pour Top (rank 2): 11.61,70.29 10.91,70.52 10.63,69.65 9.85,69.55 9.94,69.85 8.83,70.21 8.45,69.02 11.8,67.93 12.13,68.92 11.99,69.18 11.32,69.4
  pour Top (rank 2): 10.36,65.57 9.64,65.72 9.45,64.83 8.68,64.66 8.75,64.99 7.61,65.23 7.35,63.98 10.8,63.24 11.02,64.26 10.86,64.5 10.16,64.65
  pour Top (rank 2): 9.61,60.75 8.88,60.83 8.78,59.92 8.04,59.66 8.09,60.14 6.93,60.26 6.78,58.85 10.29,58.48 10.4,59.52 10.22,59.74 9.51,59.81
  pour Top (rank 2): 9.37,55.87 8.63,55.87 8.63,54.96 7.92,54.63 7.92,55.14 6.75,55.14 6.75,53.69 10.28,53.69 10.28,54.73 10.08,54.93 9.37,54.93
  pour Top (rank 2): 9.63,51 8.9,50.92 9,50.01 8.32,49.61 8.29,49.99 7.12,49.86 7.26,48.55 10.77,48.92 10.66,49.96 10.44,50.14 9.73,50.06
  pour Top (rank 2): 10.41,46.18 9.69,46.03 9.88,45.13 9.25,44.66 9.17,45.05 8.03,44.8 8.31,43.5 11.76,44.23 11.54,45.25 11.3,45.41 10.61,45.26
  pour Top (rank 2): 11.69,41.47 10.99,41.24 11.27,40.37 10.7,39.84 10.57,40.24 9.45,39.87 9.87,38.58 13.23,39.67 12.91,40.66 12.65,40.79 11.98,40.57
  pour Top (rank 2): 13.45,36.92 12.78,36.62 13.15,35.78 12.63,35.19 12.49,35.5 11.43,35.03 11.95,33.86 15.17,35.29 14.75,36.24 14.48,36.35 13.83,36.06
  pour Top (rank 2): 15.68,32.57 15.04,32.2 15.5,31.41 15.05,30.77 14.84,31.13 13.83,30.55 14.5,29.37 17.56,31.14 17.04,32.04 16.76,32.11 16.15,31.76
  pour Top (rank 2): 18.35,28.49 17.75,28.05 18.29,27.31 17.91,26.63 17.68,26.94 16.73,26.26 17.51,25.18 20.37,27.26 19.76,28.1 19.47,28.14 18.9,27.73
  pour Top (rank 2): 21.43,24.7 20.88,24.21 21.49,23.53 21.19,22.81 20.93,23.09 20.06,22.31 20.95,21.33 23.57,23.69 22.87,24.46 22.59,24.48 22.06,24
  pour Top (rank 2): 24.89,21.26 24.4,20.71 25.08,20.1 24.85,19.35 24.6,19.57 23.82,18.7 24.76,17.85 27.13,20.48 26.35,21.17 26.06,21.16 25.59,20.63
  pour Top (rank 2): 28.69,18.2 28.26,17.6 29,17.06 28.85,16.29 28.45,16.59 27.76,15.64 28.92,14.8 31,17.65 30.15,18.27 29.87,18.22 29.45,17.65
  pour Top (rank 2): 32.79,15.55 32.42,14.91 33.22,14.45 33.15,13.67 32.77,13.89 32.19,12.88 33.38,12.19 35.14,15.25 34.24,15.77 33.96,15.7 33.61,15.08
  pour Top (rank 2): 37.15,13.35 36.85,12.67 37.68,12.3 37.7,11.52 37.25,11.71 36.78,10.65 38.08,10.07 39.52,13.29 38.56,13.72 38.3,13.61 38.01,12.96
  pour Top (rank 2): 41.71,11.61 41.48,10.91 42.35,10.63 42.45,9.85 42.04,9.98 41.68,8.87 42.98,8.45 44.07,11.8 43.08,12.13 42.82,11.99 42.6,11.32
  pour Top (rank 2): 46.43,10.36 46.28,9.64 47.17,9.45 47.34,8.68 46.89,8.78 46.65,7.64 48.02,7.35 48.76,10.8 47.74,11.02 47.5,10.86 47.35,10.16
  pour Top (rank 2): 51.25,9.61 51.17,8.88 52.08,8.78 52.34,8.04 51.86,8.09 51.73,6.93 53.15,6.78 53.52,10.29 52.48,10.4 52.26,10.22 52.19,9.51
  pour Top (rank 2): 56.13,9.37 56.13,8.63 57.04,8.63 57.37,7.92 56.97,7.92 56.97,6.75 58.31,6.75 58.31,10.28 57.27,10.28 57.07,10.08 57.07,9.37
  pour Top (rank 2): 61,9.63 61.08,8.9 61.99,9 62.39,8.32 61.97,8.28 62.09,7.12 63.45,7.26 63.08,10.77 62.04,10.66 61.86,10.44 61.94,9.73
  pour Top (rank 2): 65.82,10.41 65.97,9.69 66.87,9.88 67.34,9.25 66.83,9.15 67.07,8 68.5,8.31 67.77,11.76 66.75,11.54 66.59,11.3 66.74,10.61
  pour Top (rank 2): 70.53,11.69 70.76,10.99 71.63,11.27 72.16,10.7 71.77,10.57 72.13,9.46 73.42,9.87 72.33,13.23 71.34,12.91 71.21,12.65 71.43,11.98
  pour Top (rank 2): 75.08,13.45 75.38,12.78 76.22,13.15 76.81,12.63 76.43,12.46 76.91,11.4 78.14,11.95 76.71,15.17 75.76,14.75 75.65,14.48 75.94,13.83
  pour Top (rank 2): 79.43,15.68 79.8,15.04 80.59,15.5 81.23,15.05 80.89,14.85 81.48,13.84 82.63,14.5 80.86,17.56 79.96,17.04 79.89,16.76 80.24,16.15
  pour Top (rank 2): 83.51,18.35 83.95,17.75 84.69,18.29 85.37,17.91 84.97,17.61 85.65,16.67 86.82,17.51 84.74,20.37 83.9,19.76 83.86,19.47 84.27,18.9
  pour Top (rank 2): 87.3,21.43 87.79,20.88 88.47,21.49 89.19,21.19 88.82,20.85 89.61,19.99 90.67,20.95 88.31,23.57 87.54,22.87 87.52,22.59 88,22.06
  pour Top (rank 2): 90.74,24.89 91.29,24.4 91.9,25.08 92.65,24.85 92.33,24.49 93.19,23.7 94.15,24.76 91.52,27.13 90.83,26.35 90.84,26.06 91.37,25.59
  pour Top (rank 2): 93.8,28.69 94.4,28.26 94.94,29 95.71,28.85 95.46,28.51 96.4,27.82 97.2,28.92 94.35,31 93.73,30.15 93.78,29.87 94.36,29.45
  pour Top (rank 2): 96.45,32.79 97.09,32.42 97.55,33.22 98.33,33.15 98.16,32.86 99.17,32.27 99.81,33.38 96.75,35.14 96.23,34.24 96.3,33.96 96.92,33.61
  pour Top (rank 2): 98.65,37.15 99.33,36.85 99.7,37.68 100.48,37.7 100.29,37.26 101.36,36.78 101.93,38.08 98.71,39.52 98.28,38.56 98.39,38.3 99.04,38.01
  pour Top (rank 2): 100.39,41.71 101.09,41.48 101.37,42.35 102.15,42.45 102.02,42.04 103.13,41.68 103.55,42.98 100.2,44.07 99.87,43.08 100.01,42.82 100.68,42.6
  pour Top (rank 2): 101.64,46.43 102.36,46.28 102.55,47.17 103.32,47.34 103.21,46.86 104.36,46.62 104.66,48.02 101.2,48.76 100.99,47.74 101.14,47.5 101.84,47.35
  pour Top (rank 2): 102.39,51.25 103.12,51.17 103.22,52.08 103.96,52.34 103.92,51.94 105.08,51.82 105.22,53.15 101.71,53.52 101.6,52.48 101.78,52.26 102.49,52.19
  pour Top (rank 3): 43.3,11.55 47.11,11.55 47.75,10.92 49.97,10.92 49.97,17.2 49.04,18.13 44.83,18.13 43.21,16.51 35.05,16.51 33.34,18.22 32.45,17.34 32.45,16.51 37.17,13.99 42.11,12.74 42.11,12.74
  pour Top: 94.1,72.85 94.1,69.97 95.37,68.7 99.82,68.7 99.82,69.34 99.5,69.65 99.5,70.61 99.18,70.92 99.18,71.88 98.21,72.85
  pour Top (rank 2): 54.36,10.34 53.87,10.82 53.64,10.82 51.49,11.05 50.19,11.05
  pour Top: 27.94,20.32 33.02,20.32 33.66,19.68 33.66,16.38 32.64,16.38 32.13,16.89 30.86,18.16 29.84,18.16 27.94,20.07
  pour Top: 98.68,44.96 99.44,44.96 99.95,44.45 99.95,42.45 98.68,40.64
WS2812
  Top 0.305: Q1.2 85.4,54.92 86.58,56.1 88.68,56.1 IM1.12
WS2812-0
  pour Top: 103.53,64.47 103.38,65.15 104.36,65.38 104.46,64.9 107.52,62.79 107.57,62.27 106.38,62.14 106.33,62.67
WS2812-1
  pour Top: 102.41,69.37 102.25,69.88 103.17,70.2 103.26,69.92 106.52,68.14 106.63,67.66 105.46,67.41 105.36,67.89
WS2812-2
  pour Top: 100.77,74.15 100.53,74.68 101.41,75.1 101.55,74.78 104.98,73.36 105.12,72.9 103.99,72.53 103.84,72.99
WS2812-3
  pour Top: 98.62,78.73 98.3,79.28 99.14,79.79 99.34,79.44 102.89,78.38 103.12,77.86 102.03,77.38 101.8,77.89
WS2812-4
  pour Top: 95.96,83.07 95.57,83.6 96.38,84.22 96.65,83.84 100.3,83.16 100.57,82.69 99.54,82.09 99.26,82.56
WS2812-5
  pour Top: 92.9,87.11 92.44,87.62 93.18,88.32 93.52,87.94 97.22,87.64 97.45,87.32 96.49,86.62 96.24,86.95
WS2812-5V  (via drill 0.35)
  Top 0.254: U$61.DIN 107.34,57.76 106.68,58.42 v106.17,58.42 | v87,48.26 86.36,48.9 Q1.3
  Top 0.305: R9.2 v99.06,47.62
  Bottom 0.254: 99.06,48.26 100.97,50.16 100.97,55.24 102.87,57.15 104.9,57.15 v106.17,58.42 | v99.06,47.62 99.06,48.26 | v87,48.26 99.06,48.26
WS2812-6
  pour Top: 89.42,90.8 89.03,91.15 89.7,91.93 89.97,91.68 93.68,91.78 94.06,91.36 93.17,90.56 92.79,90.99
WS2812-7
  pour Top: 85.52,94.18 85.11,94.48 85.68,95.31 86.06,95.04 89.74,95.52 89.97,95.31 89.17,94.43 88.84,94.72
WS2812-8
  pour Top: 81.46,96.99 81,97.26 81.49,98.15 81.81,97.97 85.42,98.83 85.9,98.48 85.2,97.52 84.71,97.87
WS2812-9
  pour Top: 77.07,99.42 76.64,99.61 77.03,100.55 77.28,100.43 80.78,101.67 81.3,101.37 80.7,100.34 80.19,100.64
WS2812-10
  pour Top: 72.46,101.41 71.79,101.63 72.08,102.56 72.52,102.42 75.87,104.01 76.2,103.86 75.72,102.77 75.39,102.92
WS2812-11
  pour Top: 67.6,102.87 67.06,102.99 67.24,103.96 67.58,103.89 70.75,105.82 71.1,105.71 70.73,104.57 70.38,104.69
WS2812-12
  pour Top: 62.62,103.81 62.03,103.87 62.11,104.88 62.51,104.84 65.46,107.09 65.98,106.98 65.73,105.82 65.21,105.93
WS2812-13
  pour Top: 57.62,104.28 57.03,104.28 57.01,105.25 57.37,105.25 60.07,107.8 60.6,107.75 60.48,106.56 59.94,106.61
WS2812-14
  pour Top: 52.56,104.17 52.05,104.12 51.93,105.09 52.22,105.12 54.63,107.94 55.24,107.94 55.24,106.75 54.63,106.75
WS2812-15
  pour Top: 47.54,103.54 46.9,103.41 46.68,104.37 47.1,104.46 49.21,107.52 49.67,107.56 49.79,106.38 49.33,106.33
WS2812-16
  pour Top: 42.6,102.37 42.08,102.2 41.75,103.15 42.08,103.26 43.86,106.52 44.22,106.6 44.47,105.43 44.11,105.36
WS2812-17
  pour Top: 37.83,100.71 37.22,100.44 36.79,101.36 37.22,101.55 38.64,104.98 39.08,105.12 39.45,103.98 39.01,103.84
WS2812-18
  pour Top: 33.26,98.57 32.7,98.26 32.18,99.12 32.56,99.34 33.62,102.89 34.07,103.1 34.56,102 34.11,101.8
WS2812-19
  pour Top: 28.92,95.88 28.44,95.54 27.79,96.39 28.16,96.65 28.84,100.3 29.3,100.56 29.89,99.53 29.44,99.26
WS2812-20
  pour Top: 24.9,92.9 24.43,92.48 23.73,93.22 24.06,93.52 24.36,97.22 24.71,97.47 25.41,96.51 25.06,96.25
WS2812-21
  pour Top: 21.22,89.42 20.8,88.96 20.01,89.64 20.32,89.97 20.22,93.68 20.55,93.97 21.34,93.09 21.02,92.8
WS2812-22
  pour Top: 17.91,85.6 17.57,85.12 16.71,85.72 16.96,86.06 16.48,89.74 16.81,90.1 17.69,89.3 17.37,88.94
WS2812-23
  pour Top: 15.01,81.52 14.66,80.91 13.79,81.39 14.03,81.81 13.17,85.42 13.41,85.75 14.38,85.05 14.14,84.72
WS2812-24
  pour Top: 12.57,77.09 12.3,76.48 11.38,76.86 11.57,77.28 10.33,80.78 10.58,81.21 11.61,80.61 11.36,80.19
WS2812-25
  pour Top: 10.61,72.43 10.42,71.85 9.46,72.14 9.58,72.52 7.99,75.87 8.2,76.34 9.29,75.85 9.08,75.39
WS2812-26
  pour Top: 9.16,67.56 9.04,66.98 8.02,67.18 8.11,67.58 6.18,70.75 6.28,71.08 7.42,70.71 7.31,70.38
WS2812-27
  pour Top: 8.22,62.59 8.15,61.89 7.11,61.97 7.16,62.51 4.91,65.46 4.99,65.86 6.16,65.61 6.07,65.21
WS2812-28
  pour Top: 7.78,57.57 7.77,56.88 6.75,56.86 6.75,57.37 4.2,60.07 4.24,60.46 5.43,60.34 5.39,59.94
WS2812-29
  pour Top: 7.89,52.51 7.95,51.97 6.92,51.84 6.88,52.22 4.06,54.63 4.06,55.19 5.25,55.19 5.25,54.63
WS2812-30
  pour Top: 8.51,47.51 8.64,46.9 7.63,46.67 7.54,47.1 4.49,49.21 4.44,49.61 5.63,49.73 5.67,49.33
WS2812-31
  pour Top: 9.67,42.58 9.87,41.96 8.89,41.62 8.74,42.08 5.48,43.86 5.37,44.35 6.54,44.59 6.65,44.11
WS2812-32
  pour Top: 11.3,37.82 11.56,37.25 10.63,36.81 10.45,37.22 7.02,38.64 6.89,39.07 8.02,39.44 8.16,39.01
WS2812-33
  pour Top: 13.46,33.25 13.75,32.73 12.87,32.2 12.66,32.56 9.11,33.62 8.89,34.12 9.98,34.6 10.2,34.11
WS2812-34
  pour Top: 16.04,28.93 16.38,28.46 15.58,27.85 15.35,28.16 11.7,28.84 11.49,29.2 12.53,29.8 12.74,29.44
WS2812-35
  pour Top: 19.14,24.9 19.52,24.47 18.76,23.75 18.48,24.06 14.78,24.36 14.55,24.67 15.52,25.38 15.75,25.06
WS2812-36
  pour Top: 22.58,21.22 23.03,20.81 22.35,20.02 22.03,20.32 18.32,20.22 18.02,20.55 18.91,21.35 19.2,21.02
WS2812-37
  pour Top: 26.38,17.91 26.88,17.55 26.3,16.7 25.94,16.96 22.26,16.48 21.9,16.81 22.7,17.69 23.06,17.37
WS2812-38
  pour Top: 30.45,15 31.12,14.62 30.65,13.77 30.19,14.03 26.58,13.17 26.18,13.46 26.89,14.42 27.28,14.14
WS2812-39
  pour Top: 34.94,12.58 35.47,12.35 35.08,11.4 34.72,11.57 31.22,10.33 30.79,10.58 31.38,11.61 31.81,11.36
WS2812-40
  pour Top: 39.62,10.63 40.21,10.44 39.91,9.44 39.48,9.58 36.13,7.99 35.73,8.16 36.22,9.25 36.61,9.08
WS2812-41
  pour Top: 44.47,9.18 45.07,9.05 44.87,8.01 44.42,8.11 41.25,6.18 40.82,6.32 41.19,7.45 41.62,7.31
WS2812-42
  pour Top: 49.41,8.22 50.19,8.13 50.11,7.1 49.49,7.16 46.54,4.91 46,5.02 46.25,6.19 46.79,6.07
WS2812-43
  pour Top: 54.43,7.78 55.19,7.77 55.22,6.75 54.63,6.75 51.93,4.2 51.36,4.26 51.49,5.45 52.06,5.39
WS2812-44
  pour Top: 59.5,7.9 60.1,7.96 60.23,6.92 59.78,6.88 57.37,4.06 56.86,4.06 56.86,5.25 57.37,5.25
WS2812-45
  pour Top: 64.49,8.51 64.98,8.62 65.22,7.61 64.9,7.54 62.79,4.49 62.38,4.44 62.25,5.63 62.67,5.67
WS2812-46
  pour Top: 69.42,9.67 70.04,9.87 70.38,8.89 69.92,8.74 68.14,5.48 67.58,5.36 67.33,6.53 67.89,6.65
WS2812-48
  pour Top: 78.74,13.43 79.32,13.76 79.84,12.9 79.44,12.66 78.38,9.11 77.97,8.92 77.48,10.01 77.89,10.2
WS2812-49
  pour Top: 83.07,16.07 83.61,16.45 84.23,15.63 83.84,15.35 83.16,11.7 82.8,11.49 82.2,12.53 82.56,12.74
WS2812-50
  pour Top: 87.1,19.11 87.53,19.5 88.24,18.75 87.94,18.48 87.64,14.78 87.33,14.56 86.63,15.52 86.94,15.75
WS2812-51
  pour Top: 90.78,22.57 91.26,23.09 92.03,22.42 91.68,22.03 91.78,18.32 91.47,18.04 90.67,18.93 90.98,19.2
WS2812-52
  pour Top: 94.09,26.38 94.53,26.99 95.38,26.41 95.04,25.94 95.52,22.26 95.14,21.84 94.25,22.64 94.63,23.06
WS2812-53
  pour Top: 96.98,30.53 97.28,31.05 98.18,30.56 97.97,30.19 98.83,26.58 98.58,26.24 97.62,26.94 97.86,27.28
WS2812-54
  pour Top: 99.42,34.94 99.72,35.63 100.67,35.23 100.43,34.72 101.67,31.22 101.44,30.82 100.41,31.42 100.64,31.81
WS2812-55
  pour Top: 101.38,39.6 101.51,40 102.49,39.71 102.42,39.48 104.01,36.13 103.81,35.67 102.72,36.15 102.92,36.61
WS2812-56
  pour Top: 102.83,44.46 102.94,44.97 103.97,44.78 103.89,44.42 105.82,41.25 105.68,40.8 104.54,41.17 104.69,41.62
WS2812-57
  pour Top: 103.8,49.39 103.87,50.05 104.89,49.97 104.84,49.49 107.09,46.54 107.01,46.13 105.84,46.38 105.93,46.79
WS2812-58
  pour Top: 104.3,54.35 104.3,55.17 105.25,55.19 105.25,54.63 107.8,51.93 107.76,51.52 106.57,51.64 106.61,52.06

## Text on the board
bNames: RB3203_BLACK-BOX-BOARD_V1 | GND | +5V | GND | A | B | +5v | GND | !+5V
tTest: SVP GND | GND | +3V3 | GND | SCL | SDA | TX-GPS | RX-GPS | +3V3 | SVN GND | IO34 GND | IO35 GND | IO32 GND | IO33 GND | GND | A | B | +5V